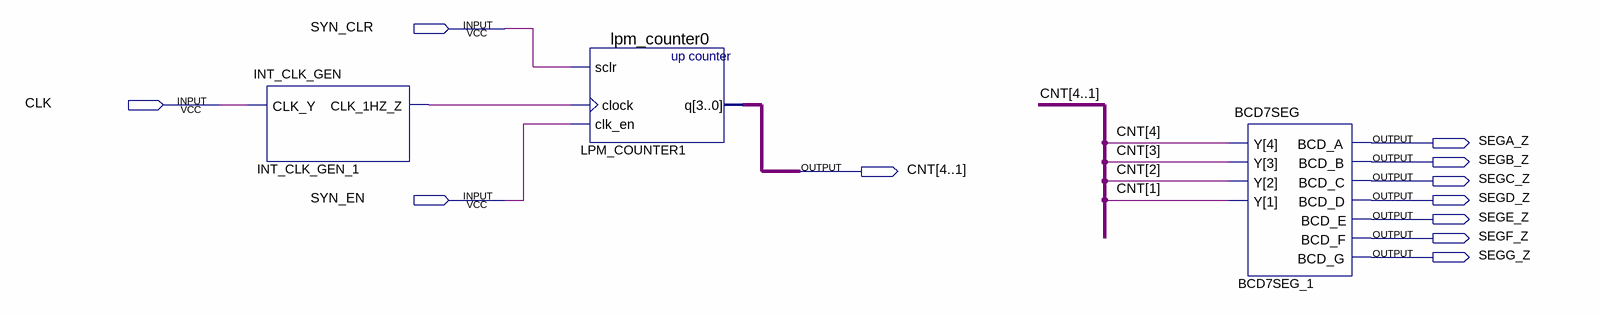
[diagram p0: schematic sheet]
// Quartus schematic design4_gudmundsson.bdf as structural Verilog: 3 symbols, 11 pins
module design4_gudmundsson (
  input  SYN_CLR,
  input  CLK,
  input  SYN_EN,
  output SEGA_Z,
  output SEGB_Z,
  output [4:1] CNT,
  output SEGC_Z,
  output SEGD_Z,
  output SEGE_Z,
  output SEGF_Z,
  output SEGG_Z
);

  wire INT_CLK_GEN_1_clk_1hz_z;

  INT_CLK_GEN INT_CLK_GEN_1 (.CLK_Y(CLK), .CLK_1HZ_Z(INT_CLK_GEN_1_clk_1hz_z));
  lpm_counter0 LPM_COUNTER1 (.sclr(SYN_CLR), .clock(INT_CLK_GEN_1_clk_1hz_z), .clk_en(SYN_EN), .q(CNT));
  BCD7SEG BCD7SEG_1 (
    .Y(CNT), .BCD_A(SEGA_Z), .BCD_B(SEGB_Z), .BCD_C(SEGC_Z), .BCD_D(SEGD_Z), .BCD_E(SEGE_Z), .BCD_F(SEGF_Z),
    .BCD_G(SEGG_Z));
endmodule
